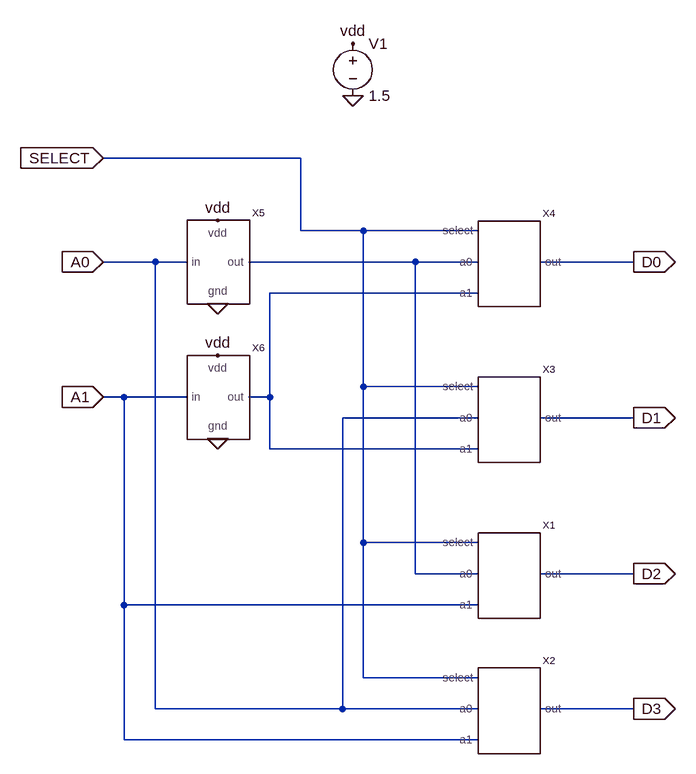
[diagram p0: schematic Addres_decoder.asc]
Addres_decoder.asc, the LTspice schematic file:
Version 4
SHEET 1 880 680
WIRE -128 -368 -432 -368
WIRE -128 -256 -128 -368
WIRE -32 -256 -128 -256
WIRE 144 -256 -32 -256
WIRE -352 -208 -432 -208
WIRE -304 -208 -352 -208
WIRE 48 -208 -208 -208
WIRE 144 -208 48 -208
WIRE 384 -208 240 -208
WIRE 144 -160 -176 -160
WIRE -32 -16 -32 -256
WIRE 144 -16 -32 -16
WIRE -400 0 -432 0
WIRE -304 0 -400 0
WIRE -176 0 -176 -160
WIRE -176 0 -208 0
WIRE 144 32 -64 32
WIRE 384 32 240 32
WIRE -176 80 -176 0
WIRE 144 80 -176 80
WIRE -32 224 -32 -16
WIRE 144 224 -32 224
WIRE 48 272 48 -208
WIRE 144 272 48 272
WIRE 384 272 240 272
WIRE -400 320 -400 0
WIRE 144 320 -400 320
WIRE -32 432 -32 224
WIRE 144 432 -32 432
WIRE -352 480 -352 -208
WIRE -64 480 -64 32
WIRE -64 480 -352 480
WIRE 144 480 -64 480
WIRE 384 480 240 480
WIRE -400 528 -400 320
WIRE 144 528 -400 528
FLAG -256 -144 0
FLAG -256 64 0
FLAG -48 -464 0
FLAG -48 -544 vdd
FLAG -256 -272 vdd
FLAG -256 -64 vdd
FLAG -432 -368 SELECT
IOPIN -432 -368 In
FLAG -432 -208 A0
IOPIN -432 -208 In
FLAG -432 0 A1
IOPIN -432 0 In
FLAG 384 -208 D0
IOPIN 384 -208 Out
FLAG 384 32 D1
IOPIN 384 32 Out
FLAG 384 272 D2
IOPIN 384 272 Out
FLAG 384 480 D3
IOPIN 384 480 Out
SYMBOL charge_decoder 208 272 R0
SYMATTR InstName X1
SYMBOL charge_decoder 208 480 R0
SYMATTR InstName X2
SYMBOL charge_decoder 208 32 R0
SYMATTR InstName X3
SYMBOL charge_decoder 208 -208 R0
SYMATTR InstName X4
SYMBOL invert -256 -208 R0
SYMATTR InstName X5
SYMBOL invert -256 0 R0
SYMATTR InstName X6
SYMBOL voltage -48 -560 R0
WINDOW 123 0 0 Left 0
WINDOW 39 0 0 Left 0
SYMATTR InstName V1
SYMATTR Value 1.5

The netlist it stands for:
* Addres_decoder.asc
XX1 SELECT N001 A1 D2 charge_decoder  ; pins select a0 a1 out
XX2 SELECT A0 A1 D3 charge_decoder  ; pins select a0 a1 out
XX3 SELECT A0 N002 D1 charge_decoder  ; pins select a0 a1 out
XX4 SELECT N001 N002 D0 charge_decoder  ; pins select a0 a1 out
XX5 A0 vdd 0 N001 invert  ; pins in vdd gnd out
XX6 A1 vdd 0 N002 invert  ; pins in vdd gnd out
V1 vdd 0 1.5
.backanno
.end